# Altium schematic sheet Bank 0_Bank 14.SchDoc
size A3; SheetNumber: 13; SheetTotal: 32
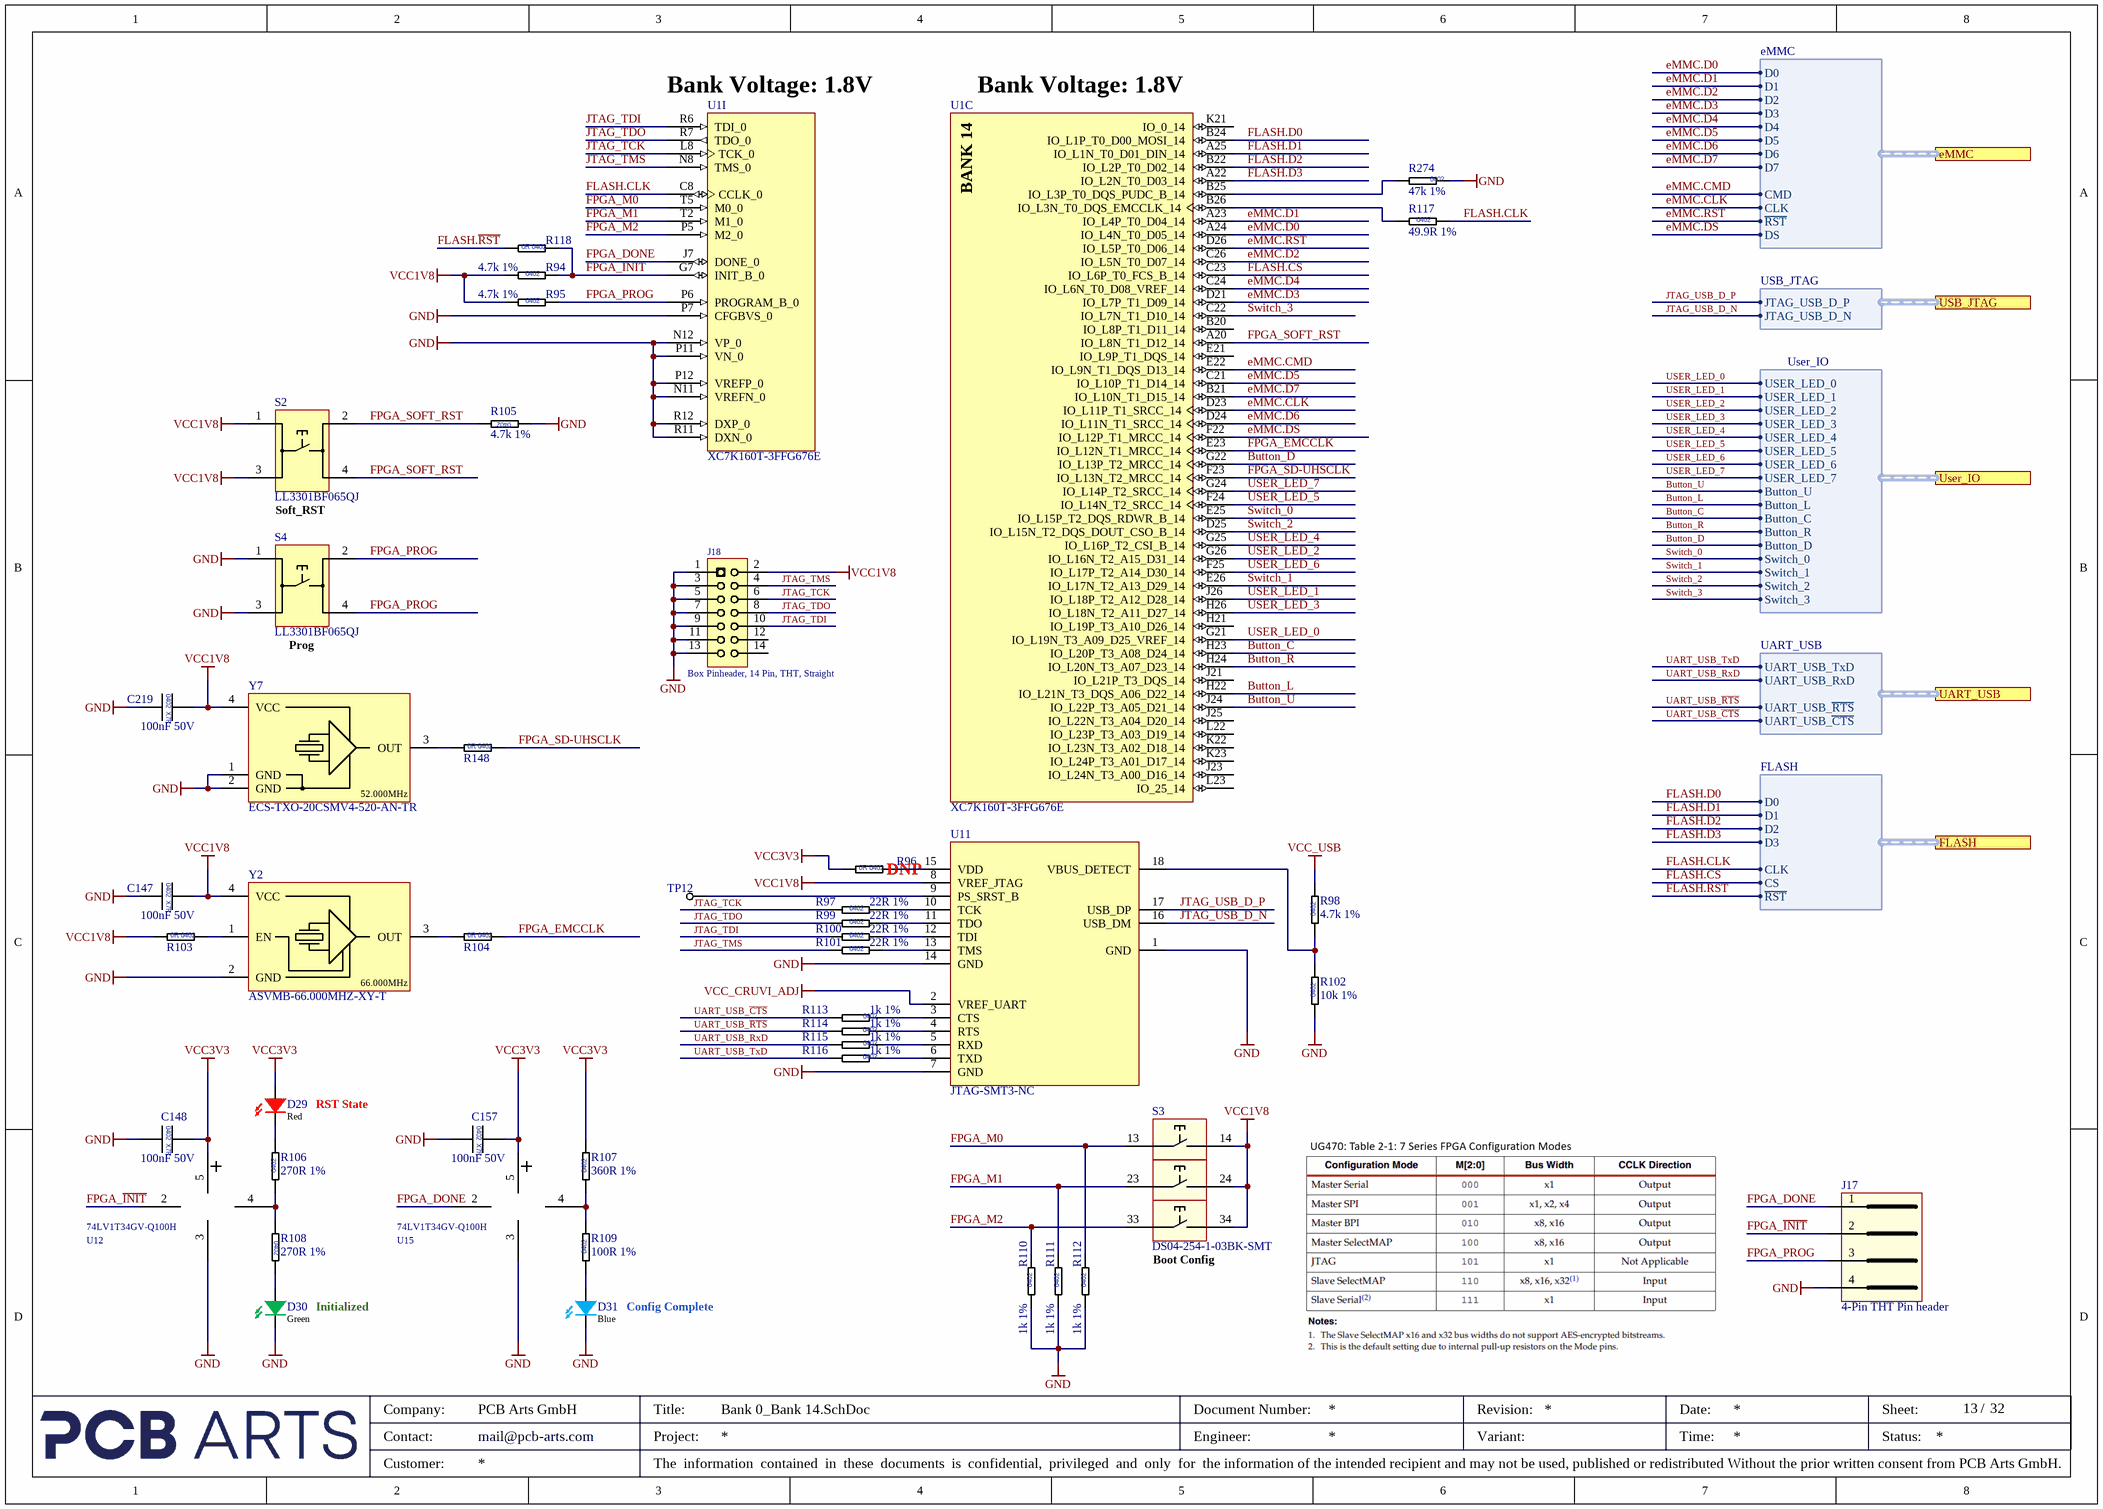
[diagram p0: Bank 0_Bank 14.SchDoc]

## Parts
C147  100nF 50V  [CAP_0402_L]
C148  100nF 50V  [CAP_0402_L]
C157  100nF 50V  [CAP_0402_L]
C219  100nF 50V  [CAP_0402_L]
D29  Color: Red  [LED-0603 Sideview]  (hidden comment: LTST-S270KRKT)
D30  Color: Green  [LED-0603 Sideview]  (hidden comment: LTST-S270KGKT)
D31  Color: Blue  [LED-0603 Sideview]  (hidden comment: LTST-S270TBKT)
J17  4-Pin THT Pin header  [61300411121]
J18  Box Pinheader, 14 Pin, THT, Straight  [87832-1420]
R94  4.7k 1%  [RES_0402_L]
R95  4.7k 1%  [RES_0402_L]
R96  0R Jumper  [RES_0402_L]  (value not drawn)  (no BOM)
R97  22R 1%  [RES_0402_L]
R98  4.7k 1%  [RES_0402_L]
R99  22R 1%  [RES_0402_L]
R100  22R 1%  [RES_0402_L]
R101  22R 1%  [RES_0402_L]
R102  10k 1%  [RES_0402_L]
R103  0R Jumper  [RES_0402_L]  (value not drawn)
R104  0R Jumper  [RES_0402_L]  (value not drawn)
R105  4.7k 1%  [RES_0402_L]
R106  270R 1%  [RES_0402_L]
R107  360R 1%  [RES_0402_L]
R108  270R 1%  [RES_0402_L]
R109  100R 1%  [RES_0402_L]
R110  1k 1%  [RES_0402_L]
R111  1k 1%  [RES_0402_L]
R112  1k 1%  [RES_0402_L]
R113  1k 1%  [RES_0402_L]
R114  1k 1%  [RES_0402_L]
R115  1k 1%  [RES_0402_L]
R116  1k 1%  [RES_0402_L]
R117  49.9R 1%  [RES_0402_L]
R118  0R Jumper  [RES_0402_L]  (value not drawn)
R148  0R Jumper  [RES_0402_L]  (value not drawn)
R274  47k 1%  [RES_0402_L]
S2  LL3301BF065QJ  [LL3301BF065QJ]
S3  DS04-254-1-03BK-SMT  [CUI DS04-254-SMT Series, 3 Pole]
S4  LL3301BF065QJ  [LL3301BF065QJ]
TP12  Testpoint  [Testpoint 0.8mm]  (value not drawn)  (no BOM)
U1  XC7K160T-3FFG676E  [BGA100P2700X2700X317-676N]  (parts C,I of 14)
U11  JTAG-SMT3-NC  [JTAG-SMT3-NC]
U12  74LV1T34GV-Q100H  [SOT95P275X110-5N]
U15  74LV1T34GV-Q100H  [SOT95P275X110-5N]
Y2  ASVMB-66.000MHZ-XY-T  [ASVMB Series]
Y7  ECS-TXO-20CSMV4-520-AN-TR  [ECS-TXO-20CSMV4_2X1.6X0.8]

## Ports
eMMC (harness eMMC, see Top-Level-Sheet[4B], Memory-QSPI_Flash-eMMC[1A]), FLASH (harness FLASH, see Top-Level-Sheet[4B], Memory-QSPI_Flash-eMMC[1C]), UART_USB (harness UART_USB, see Top-Level-Sheet[4B], Bank 13_Bank 15_Bank 16[8A]), USB_JTAG (harness USB_JTAG, see Top-Level-Sheet[4B], USB-HUB-MUX[8C]), User_IO (harness User_IO, see Top-Level-Sheet[4B], HMI[1A])

## Harnesses
USB_JTAG: JTAG_USB_D_P, JTAG_USB_D_N
UART_USB: UART_USB_TxD, UART_USB_RxD, UART_USB_~{RTS}, UART_USB_~{CTS}
FLASH: D0, D1, D2, D3, CLK, CS, ~{RST}
eMMC: D0, D1, D2, D3, CLK, CMD, ~{RST}, D4, D5, D6, D7, DS
User_IO: USER_LED_0, USER_LED_1, USER_LED_2, USER_LED_3, USER_LED_4, USER_LED_5, USER_LED_6, USER_LED_7, Switch_0, Switch_1, Switch_2, Switch_3, Button_L, Button_U, Button_C, Button_R, Button_D

## Nets
GND: C147.2 C148.2 C157.2 C219.2 D30.1 D31.1 J17.4 J18.1 J18.3 J18.5 J18.7 J18.9 J18.11 J18.13 R102.1 R105.1 R110.1 R111.1 R112.1 R274.1 S4.1 S4.3 U1.N11(VREFN_0) U1.N12(VP_0) U1.P7(CFGBVS_0) U1.P11(VN_0) U1.P12(VREFP_0) U1.R11(DXN_0) U1.R12(DXP_0) U11.1(GND) U11.7(GND) U11.14(GND) U12.3(GND) U15.3(GND) Y2.2(GND) Y7.1(GND) Y7.2(GND)
VCC1V8: C147.1 C219.1 J18.2 R94.1 R95.1 R103.1 S2.1 S2.3 S3.14 S3.24 S3.34 U11.8(VREF_JTAG) Y2.4(VCC) Y7.4(VCC)
VCC3V3: C148.1 C157.1 D29.2 R96.1 R107.2 U12.5(VCC) U15.5(VCC)
VCC_CRUVI_ADJ: U11.2(VREF_UART)
VCC_USB: R98.2
Button_C: U1.H23(IO_L20P_T3_A08_D24_14) ; port User_IO.Button_C
Button_D: U1.G22(IO_L13P_T2_MRCC_14) ; port User_IO.Button_D
Button_L: U1.H22(IO_L21N_T3_DQS_A06_D22_14) ; port User_IO.Button_L
Button_R: U1.H24(IO_L20N_T3_A07_D23_14) ; port User_IO.Button_R
Button_U: U1.J24(IO_L22P_T3_A05_D21_14) ; port User_IO.Button_U
eMMC.CLK: U1.D23(IO_L11P_T1_SRCC_14) ; port eMMC.CLK
eMMC.CMD: U1.E22(IO_L9N_T1_DQS_D13_14) ; port eMMC.CMD
eMMC.D0: U1.A24(IO_L4N_T0_D05_14) ; port eMMC.D0
eMMC.D1: U1.A23(IO_L4P_T0_D04_14) ; port eMMC.D1
eMMC.D2: U1.C26(IO_L5N_T0_D07_14) ; port eMMC.D2
eMMC.D3: U1.D21(IO_L7P_T1_D09_14) ; port eMMC.D3
eMMC.D4: U1.C24(IO_L6N_T0_D08_VREF_14) ; port eMMC.D4
eMMC.D5: U1.C21(IO_L10P_T1_D14_14) ; port eMMC.D5
eMMC.D6: U1.D24(IO_L11N_T1_SRCC_14) ; port eMMC.D6
eMMC.D7: U1.B21(IO_L10N_T1_D15_14) ; port eMMC.D7
eMMC.DS: U1.F22(IO_L12P_T1_MRCC_14) ; port eMMC.DS
eMMC.~{RST}: U1.D26(IO_L5P_T0_D06_14) ; port eMMC.~{RST}
FLASH.~{CS}: U1.C23(IO_L6P_T0_FCS_B_14) ; port FLASH.CS
FLASH.CLK: R117.2 U1.C8(CCLK_0) ; port FLASH.CLK
FLASH.D0: U1.B24(IO_L1P_T0_D00_MOSI_14) ; port FLASH.D0
FLASH.D1: U1.A25(IO_L1N_T0_D01_DIN_14) ; port FLASH.D1
FLASH.D2: U1.B22(IO_L2P_T0_D02_14) ; port FLASH.D2
FLASH.D3: U1.A22(IO_L2N_T0_D03_14) ; port FLASH.D3
FLASH.~{RST}: R118.1 ; port FLASH.~{RST}
FPGA_DONE: J17.1 U1.J7(DONE_0) U15.2(A)
FPGA_EMCCLK: R104.2 U1.E23(IO_L12N_T1_MRCC_14)
FPGA_~{INIT}: J17.2 R94.2 R118.2 U1.G7(INIT_B_0) U12.2(A)
FPGA_M0: R112.2 S3.13 U1.T5(M0_0)
FPGA_M1: R111.2 S3.23 U1.T2(M1_0)
FPGA_M2: R110.2 S3.33 U1.P5(M2_0)
FPGA_PROG: J17.3 R95.2 S4.2 S4.4 U1.P6(PROGRAM_B_0)
FPGA_SD-UHSCLK: R148.2 U1.F23(IO_L13N_T2_MRCC_14)
FPGA_SOFT_RST: R105.2 S2.2 S2.4 U1.A20(IO_L8N_T1_D12_14)
JTAG_TCK: J18.6 R97.1 U1.L8(TCK_0)
JTAG_TDI: J18.10 R100.1 U1.R6(TDI_0)
JTAG_TDO: J18.8 R99.1 U1.R7(TDO_0)
JTAG_TMS: J18.4 R101.1 U1.N8(TMS_0)
JTAG_USB_D_N: U11.16(USB_DM) ; port USB_JTAG.JTAG_USB_D_N
JTAG_USB_D_P: U11.17(USB_DP) ; port USB_JTAG.JTAG_USB_D_P
Switch_0: U1.E25(IO_L15P_T2_DQS_RDWR_B_14) ; port User_IO.Switch_0
Switch_1: U1.E26(IO_L17N_T2_A13_D29_14) ; port User_IO.Switch_1
Switch_2: U1.D25(IO_L15N_T2_DQS_DOUT_CSO_B_14) ; port User_IO.Switch_2
Switch_3: U1.C22(IO_L7N_T1_D10_14) ; port User_IO.Switch_3
UART_USB_~{CTS}: R113.2 ; port UART_USB.UART_USB_~{CTS}
UART_USB_~{RTS}: R114.2 ; port UART_USB.UART_USB_~{RTS}
UART_USB_RxD: R115.2 ; port UART_USB.UART_USB_RxD
UART_USB_TxD: R116.2 ; port UART_USB.UART_USB_TxD
USER_LED_0: U1.G21(IO_L19N_T3_A09_D25_VREF_14) ; port User_IO.USER_LED_0
USER_LED_1: U1.J26(IO_L18P_T2_A12_D28_14) ; port User_IO.USER_LED_1
USER_LED_2: U1.G26(IO_L16N_T2_A15_D31_14) ; port User_IO.USER_LED_2
USER_LED_3: U1.H26(IO_L18N_T2_A11_D27_14) ; port User_IO.USER_LED_3
USER_LED_4: U1.G25(IO_L16P_T2_CSI_B_14) ; port User_IO.USER_LED_4
USER_LED_5: U1.F24(IO_L14N_T2_SRCC_14) ; port User_IO.USER_LED_5
USER_LED_6: U1.F25(IO_L17P_T2_A14_D30_14) ; port User_IO.USER_LED_6
USER_LED_7: U1.G24(IO_L14P_T2_SRCC_14) ; port User_IO.USER_LED_7
NetD29_1: D29.1 R106.2
NetD30_2: D30.2 R108.2
NetD31_2: D31.2 R109.1
NetR96_2: R96.2 U11.15(VDD)
NetR97_2: R97.2 U11.10(TCK)
NetR98_1: R98.1 R102.2 U11.18(VBUS_DETECT)
NetR99_2: R99.2 U11.11(TDO)
NetR100_2: R100.2 U11.12(TDI)
NetR101_2: R101.2 U11.13(TMS)
NetR103_2: R103.2 Y2.1(EN)
NetR104_1: R104.1 Y2.3(OUT)
NetR106_1: R106.1 R108.1 U12.4(Y)
NetR107_1: R107.1 R109.2 U15.4(Y)
NetR113_1: R113.1 U11.3(CTS)
NetR114_1: R114.1 U11.4(RTS)
NetR115_1: R115.1 U11.5(RXD)
NetR116_1: R116.1 U11.6(TXD)
NetR117_1: R117.1 U1.B26(IO_L3N_T0_DQS_EMCCLK_14)
NetR148_1: R148.1 Y7.3(OUT)
NetR274_2: R274.2 U1.B25(IO_L3P_T0_DQS_PUDC_B_14)
NetTP12_1: TP12.1(GND) U11.9(PS_SRST_B)

Not connected (* = marked no-connect by the designer): J18 12 14; U1 B20(IO_L8P_T1_D11_14) E21(IO_L9P_T1_DQS_14) H21(IO_L19P_T3_A10_D26_14) J21(IO_L21P_T3_DQS_14) J23(IO_L24N_T3_A00_D16_14) J25(IO_L22N_T3_A04_D20_14) K21(IO_0_14) K22(IO_L23N_T3_A02_D18_14) K23(IO_L24P_T3_A01_D17_14) L22(IO_L23P_T3_A03_D19_14) L23(IO_25_14)

## Notes on the sheet
- (near U1) Bank Voltage: 1.8V
- Soft_RST
- (near S4) Prog
- (near R96) DNP
- RST State
- (near S3) Boot Config
- Initialized
- Config Complete
- Company:
- Contact:
- Customer:
- mail@pcb-arts.com
- PCB Arts GmbH
- Title:
- Project:
- The  information  contained  in  these  documents  is  confidential,  privileged  and  only  for  the information of the intended recipient and may not be used, published or redistributed Without the prior written consent from PCB Arts GmbH.
- Engineer:
- Document Number:
- Revision:
- Variant:
- Date:
- Time:
- Sheet:
- Status:
- /
- (in symbol ASVMB-66.000MHZ-XY-T_Clock-Memsoszillator 66.000MHz 1.8V 10ppm -40C +105C) 66.000MHz
- (in symbol CAP_0402_100nF_50V) 0402; X7R
- (in symbol ECS-TXO-20CSMV4-520-AN-TR_52.000MHz Clock Oscillator, 1V7-3V6) 52.000MHz
- (in symbol RES_0402_0R Jumper) 0R 0402
- (in symbol RES_0402_1k_1%) 0402
- (in symbol RES_0402_4.7k_1%) 0402
- (in symbol RES_0402_10k_1%) 0402
- (in symbol RES_0402_22R_1%) 0402
- (in symbol RES_0402_47k_1%) 0402
- (in symbol RES_0402_49.9R_1%) 0402
- (in symbol RES_0402_100R_1%) 0402
- (in symbol RES_0402_270R 1%) 0402
- (in symbol RES_0402_360R_1%) 0402
- (in symbol XC7K160T-3FFG676E_Kintex-7 FPGA, 400 User I/Os, 8 GTX, FFG676, part C) BANK 14

## Library data of the parts
C147 C148 C157 C219 = CAP_0402_100nF_50V: Multilayer Ceramic Capacitors MLCC - SMD/SMT 0402 50VDC; Manufacturer 1: Murata Electronics; Manufacturer 1 Prt. Nr.: GCM155L8EH104KE07D; Manufacturer 2 Prt. Nr.: UMK105B7104KV-FR; Manufacturer 2: TDK
D29 = LED 0603 Red Sideview: RED  0603 Light Emitting Diode; Manufacturer 1: lite-On; Manufacturer 1 Prt. Nr.: LTST-S270KRKT
D30 = LED 0603 Green Sideview: GREEN  0603 Light Emitting Diode; Manufacturer 1: lite-On; Manufacturer 1 Prt. Nr.: LTST-S270KGKT
D31 = LED 0603 Blue Sideview: BLUE  0603 Light Emitting Diode; Manufacturer 1: lite-On; Manufacturer 1 Prt. Nr.: LTST-S270TBKT
J17 = 61300411121_WR-PHD 2.54mm 4Pin THT Header: WR-PHD 2.54mm 4Pin THT Header; Manufacturer 1: Würth Elektronik; Manufacturer 1 Prt. Nr.: 61300411121
J18 = 87832-1420_Box Pin header THT 2.00mm Box 14Pol Straight: Box Pin header THT 2.00mm 14Pol Straight; Manufacturer 1: Molex; Manufacturer 1 Prt. Nr.: 87832-1420
R94 R95 R98 R105 = RES_0402_4.7k_1%: Thick Film Resistors - SMD 4.7kOhm 1%; Manufacturer 1: Vishay / Dale; Manufacturer 1 Prt. Nr.: CRCW04024K70FKEDC; Manufacturer 2 Prt. Nr.: RC0402FR-134K7L; Manufacturer 2: Yageo
R96 R103 R104 R118 R148 = RES_0402_0R Jumper: Thick Film Resistors - SMD 0Ohm; Manufacturer 1: Vishay / Dale; Manufacturer 1 Prt. Nr.: CRCW04020000Z0EDC; Manufacturer 2 Prt. Nr.: RC0402JR-070RL; Manufacturer 2: Yageo
R97 R99-R101 = RES_0402_22R_1%: Thick Film Resistors - SMD 22Ohm 1%; Manufacturer 1: Vishay / Dale; Manufacturer 1 Prt. Nr.: CRCW040222R0FKEDC; Manufacturer 2 Prt. Nr.: RC0402FR-7W22RL; Manufacturer 2: Yageo
R102 = RES_0402_10k_1%: Thick Film Resistors - SMD 10kOhm 1%; Manufacturer 1: Vishay / Dale; Manufacturer 1 Prt. Nr.: CRCW040210K0FKEDC; Manufacturer 2 Prt. Nr.: RC0402FR-7W10KL; Manufacturer 2: Yageo
R106 R108 = RES_0402_270R 1%: Thick Film Resistors - SMD 270Ohm 1%; Manufacturer 1: Vishay / Dale; Manufacturer 1 Prt. Nr.: CRCW0402270RFKEDC; Manufacturer 2 Prt. Nr.: RC0402FR-07270RL; Manufacturer 2: Yageo
R107 = RES_0402_360R_1%: Thick Film Resistors - SMD 360Ohm 1%; Manufacturer 1: Vishay / Dale; Manufacturer 1 Prt. Nr.: CRCW0402360RFKED; Manufacturer 2 Prt. Nr.: AC0402FR-07360RL; Manufacturer 2: Yageo
R109 = RES_0402_100R_1%: Thick Film Resistors - SMD 100Ohm 1%; Manufacturer 1: Vishay / Dale; Manufacturer 1 Prt. Nr.: CRCW0402100RFKEE; Manufacturer 2 Prt. Nr.: RC0402FR-7W100RL; Manufacturer 2: Yageo
R110-R116 = RES_0402_1k_1%: Thick Film Resistors - SMD 1kOhm 1%; Manufacturer 1: Vishay / Dale; Manufacturer 1 Prt. Nr.: CRCW04021K00FKEDC; Manufacturer 2 Prt. Nr.: RC0402FR-7W1KL; Manufacturer 2: Yageo
R117 = RES_0402_49.9R_1%: Thick Film Resistors - SMD 49.9Ohm 1%; Manufacturer 1: Vishay / Dale; Manufacturer 1 Prt. Nr.: CRCW040249R9FKEDC; Manufacturer 2 Prt. Nr.: RC0402FR-7W49R9L; Manufacturer 2: Yageo
R274 = RES_0402_47k_1%: Thick Film Resistors - SMD 47kOhm 1%; Manufacturer 1: Vishay / Dale; Manufacturer 1 Prt. Nr.: CRCW040247K0FKEDC; Manufacturer 2 Prt. Nr.: RC0402FR-7W47KL; Manufacturer 2: Yageo
S2 S4 = LL3301BF065QJ_SPST Top Actuated  Button, 65gf, SMD h: 9.8mm: SPST Top Actuated  Button, 65gf, SMD h: 9.8mm; Manufacturer 1: E-Switch; Manufacturer 1 Prt. Nr.: LL3301BF065QJ
S3 = DS04-254-1-03BK-SMT: SMD DIP Switch, 3 Pos, Slide actuator; Manufacturer 1: CUI Devices; Manufacturer 1 Prt. Nr.: DS04-254-1-03BK-SMT
TP12 = Testpoint 0.8mm
U1 = XC7K160T-3FFG676E_Kintex-7 FPGA, 400 User I/Os, 8 GTX, FFG676: Kintex-7 FPGA, 400 User I/Os, 8 GTX, 676-Ball BGA, Speed Grade 3, Extended Grade, Pb-Free; Manufacturer 1: Xilinx; Manufacturer 1 Prt. Nr.: XC7K160T-3FFG676E; ComponentLink1URL: http://www.xilinx.com/support/documentation/data_sheets/ds180_7Series_Overview.pdf; ComponentLink2URL: http://www.xilinx.com/support/documentation/user_guides/ug865-Zynq-7000-Pkg-Pinout.pdf; ComponentLink1Description: Datasheet; ComponentLink2Description: Package Specification
U11 = JTAG-SMT3-NC_Surface-mount JTAG Programming + UART Module: Surface-mount JTAG Programming + UART Module; Manufacturer 1: Digilent; Manufacturer 1 Prt. Nr.: JTAG-SMT3-NC
U12 U15 = 74LV1T34GV-Q100H_Single supply translating buffe: Single supply translating buffer; Manufacturer 1: Nexperia; Manufacturer 1 Prt. Nr.: 74LV1T34GV-Q100H
Y2 = ASVMB-66.000MHZ-XY-T_Clock-Memsoszillator 66.000MHz 1.8V 10ppm -40C +105C: Clock-Memsoszillator 66.000MHz 1.8V 10ppm -40C +105C; Manufacturer 1: ABRACON; Manufacturer 1 Prt. Nr.: ASVMB-66.000MHZ-XY-T
Y7 = ECS-TXO-20CSMV4-520-AN-TR_52.000MHz Clock Oscillator, 1V7-3V6: Clock-Standardoszillatoren 52.000MHz 1.7V 3.6V 0.5ppm -40C +85C; Manufacturer 1: ECS; Manufacturer 1 Prt. Nr.: ECS-TXO-20CSMV4-520-AN-TR